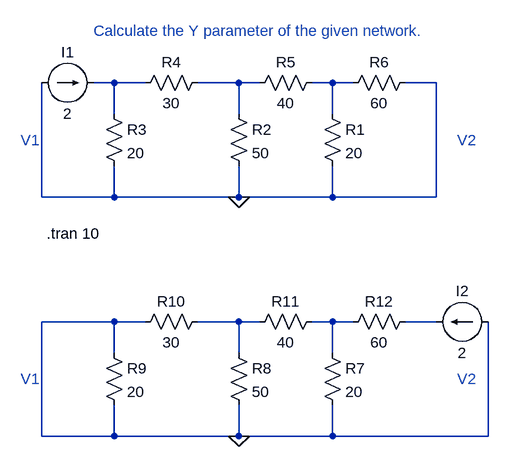
[diagram p0: schematic Lab6_ques4.asc]
Lab6_ques4.asc, the LTspice schematic file:
Version 4
SHEET 1 880 704
WIRE 0 144 -32 144
WIRE 48 144 0 144
WIRE 192 144 128 144
WIRE 224 144 192 144
WIRE 336 144 304 144
WIRE 368 144 336 144
WIRE 496 144 448 144
WIRE 0 192 0 144
WIRE 192 192 192 144
WIRE 336 192 336 144
WIRE -112 320 -112 144
WIRE 0 320 0 272
WIRE 0 320 -112 320
WIRE 192 320 192 272
WIRE 192 320 0 320
WIRE 336 320 336 272
WIRE 336 320 192 320
WIRE 496 320 496 144
WIRE 496 320 336 320
WIRE 0 512 -112 512
WIRE 48 512 0 512
WIRE 192 512 128 512
WIRE 224 512 192 512
WIRE 336 512 304 512
WIRE 368 512 336 512
WIRE 496 512 448 512
WIRE 0 560 0 512
WIRE 192 560 192 512
WIRE 336 560 336 512
WIRE -112 688 -112 512
WIRE 0 688 0 640
WIRE 0 688 -112 688
WIRE 192 688 192 640
WIRE 192 688 0 688
WIRE 336 688 336 640
WIRE 336 688 192 688
WIRE 576 688 576 512
WIRE 576 688 336 688
FLAG 192 320 0
FLAG 192 688 0
SYMBOL Res 320 176 R0
SYMATTR InstName R1
SYMATTR Value 20
SYMBOL Res 176 176 R0
SYMATTR InstName R2
SYMATTR Value 50
SYMBOL Res -16 176 R0
SYMATTR InstName R3
SYMATTR Value 20
SYMBOL Res 144 128 R90
WINDOW 0 0 56 VBottom 2
WINDOW 3 32 56 VTop 2
SYMATTR InstName R4
SYMATTR Value 30
SYMBOL Res 320 128 R90
WINDOW 0 0 56 VBottom 2
WINDOW 3 32 56 VTop 2
SYMATTR InstName R5
SYMATTR Value 40
SYMBOL Res 464 128 R90
WINDOW 0 0 56 VBottom 2
WINDOW 3 32 56 VTop 2
SYMATTR InstName R6
SYMATTR Value 60
SYMBOL current -112 144 R270
WINDOW 0 32 40 VTop 2
WINDOW 3 -32 40 VBottom 2
SYMATTR InstName I1
SYMATTR Value 2
SYMBOL Res 320 544 R0
SYMATTR InstName R7
SYMATTR Value 20
SYMBOL Res 176 544 R0
SYMATTR InstName R8
SYMATTR Value 50
SYMBOL Res -16 544 R0
SYMATTR InstName R9
SYMATTR Value 20
SYMBOL Res 144 496 R90
WINDOW 0 0 56 VBottom 2
WINDOW 3 32 56 VTop 2
SYMATTR InstName R10
SYMATTR Value 30
SYMBOL Res 320 496 R90
WINDOW 0 0 56 VBottom 2
WINDOW 3 32 56 VTop 2
SYMATTR InstName R11
SYMATTR Value 40
SYMBOL Res 464 496 R90
WINDOW 0 0 56 VBottom 2
WINDOW 3 32 56 VTop 2
SYMATTR InstName R12
SYMATTR Value 60
SYMBOL current 576 512 R90
WINDOW 0 -32 40 VBottom 2
WINDOW 3 32 40 VTop 2
SYMATTR InstName I2
SYMATTR Value 2
TEXT -32 64 Left 2 ;Calculate the Y parameter of the given network.
TEXT -104 376 Left 2 !.tran 10
TEXT 528 232 Left 2 ;V2
TEXT -144 232 Left 2 ;V1
TEXT 528 600 Left 2 ;V2
TEXT -144 600 Left 2 ;V1

The netlist it stands for:
* Lab6_ques4.asc
R1 N003 0 20
R2 N002 0 50
R3 N001 0 20
R4 N002 N001 30
R5 N003 N002 40
R6 0 N003 60
I1 0 N001 2
R7 N005 0 20
R8 N004 0 50
R9 0 0 20
R10 N004 0 30
R11 N005 N004 40
R12 N006 N005 60
I2 0 N006 2
* Calculate the Y parameter of the given network.
.tran 10
* V2
* V1
* V2
* V1
.backanno
.end